# Altium schematic sheet 0402WGF2200TCE1_0402WGF2200TCE.schdoc
size 127 x 99 mm
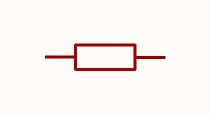
[diagram p0: 0402WGF2200TCE1_0402WGF2200TCE.schdoc]

## Parts
R?  220Ω  [R0402]  (value not drawn)

## Nets

Not connected (* = marked no-connect by the designer): R? 1 2

## Library data of the parts
R? = 0402WGF2200TCE: Manufacturer: UNI-ROYAL(厚声); Add into BOM: yes; Tolerance: ±1%; Power(Watts): 62.5mW; Voltage-Supply(Max): 50V; Temperature Coefficient: ±100ppm/℃; Symbol: 0402WGF2200TCE; Device: 0402WGF2200TCE; LCSC Part Name: 220Ω ±1% 62.5mW 厚膜电阻; Supplier Part: C25091; Manufacturer Part: 0402WGF2200TCE; Supplier Footprint: 0402; JLCPCB Part Class: Basic Part; Datasheet: https://item.szlcsc.com/datasheet/0402WGF2200TCE/25834.html; Supplier: LCSC; Convert to PCB: yes; Type: 厚膜电阻; Value: 220Ω; Operating Temperature: -55℃~+155℃